# EAGLE design ESC (EAGLE 9.5.2)

## Sheet 1 of 3: Connectors
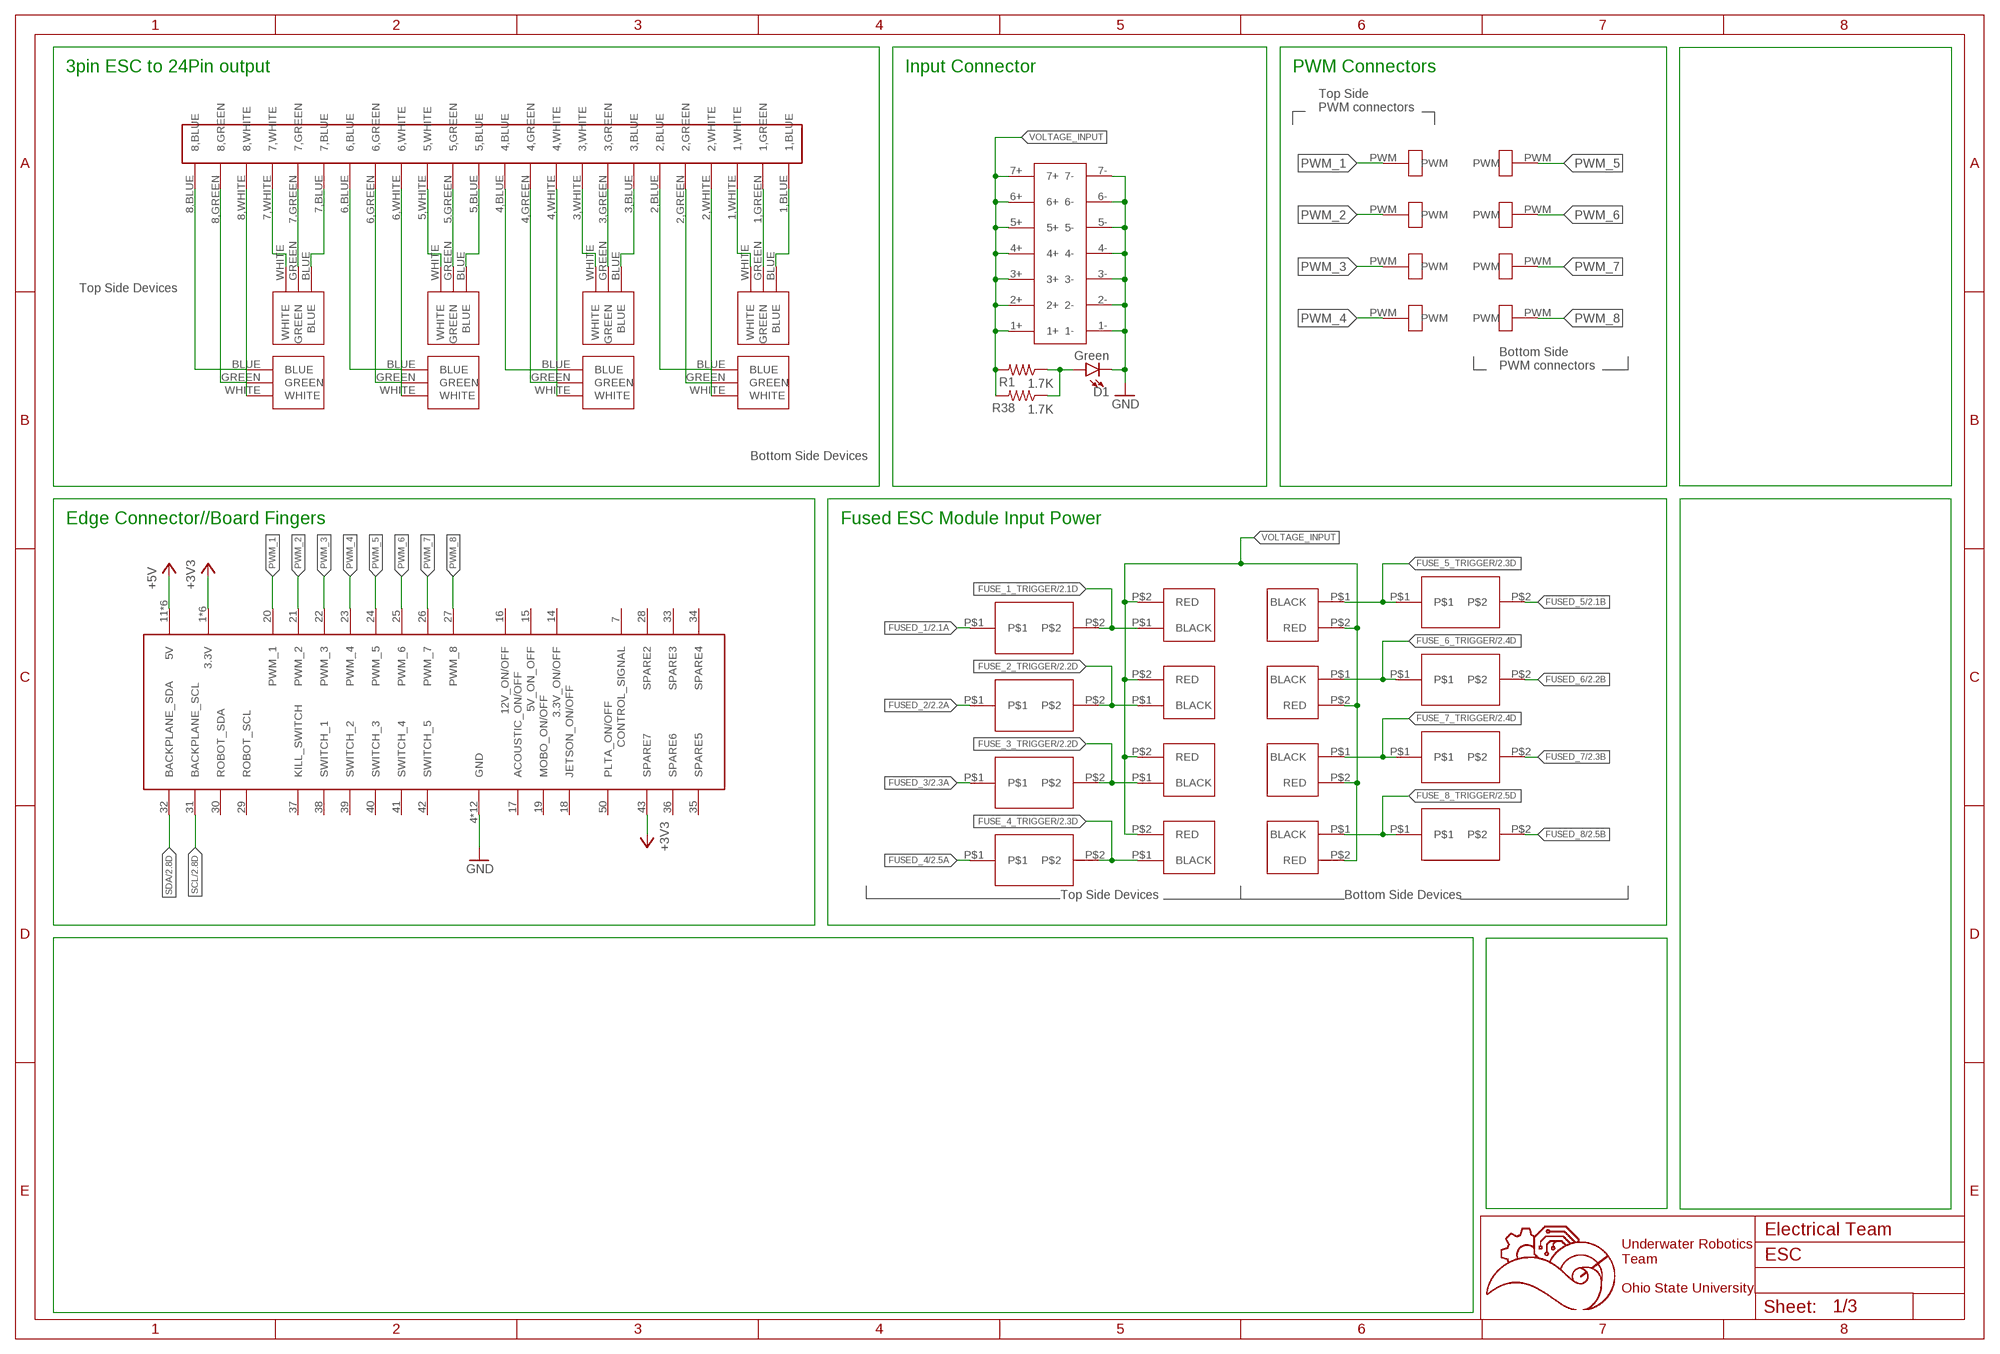
[diagram p0: schematic, sheet 1]

### Parts
2-PIN_1  1755736  [1755736]
2-PIN_2  1755736  [1755736]
2-PIN_3  1755736  [1755736]
2-PIN_4  1755736  [1755736]
2-PIN_5  1755736  [1755736]
2-PIN_6  1755736  [1755736]
2-PIN_7  1755736  [1755736]
2-PIN_8  1755736  [1755736]
3-PIN_1  1755749  [1755749]
3-PIN_2  1755749  [1755749]
3-PIN_3  1755749  [1755749]
3-PIN_4  1755749  [1755749]
3-PIN_5  1755749  [1755749]
3-PIN_6  1755749  [1755749]
3-PIN_7  1755749  [1755749]
3-PIN_8  1755749  [1755749]
24-PIN_CONNECTOR  24PINCONVERTER  [24PINCONVERTER]
D1  Green  LED0603  [LED-0603]
EDGE_CONNECTOR  5530843-EDGE  [5530843-6-BOARDFINGERS]
F1  1206FUSEHOLDER  [1206FUSEHOLDER]
F2  1206FUSEHOLDER  [1206FUSEHOLDER]
F3  1206FUSEHOLDER  [1206FUSEHOLDER]
F4  1206FUSEHOLDER  [1206FUSEHOLDER]
F5  1206FUSEHOLDER  [1206FUSEHOLDER]
F6  1206FUSEHOLDER  [1206FUSEHOLDER]
F7  1206FUSEHOLDER  [1206FUSEHOLDER]
F8  1206FUSEHOLDER  [1206FUSEHOLDER]
POWER_INPUT  14PIN_VERT  [14PIN_VERT]
R1  1.7K  R-US_R1210  [R1210]
R38  1.7K  R-US_R1210  [R1210]
U$1  MALE1PINHEADER  [MALE1PINHEADER]
U$2  MALE1PINHEADER  [MALE1PINHEADER]
U$3  MALE1PINHEADER  [MALE1PINHEADER]
U$4  MALE1PINHEADER  [MALE1PINHEADER]
U$5  MALE1PINHEADER  [MALE1PINHEADER]
U$6  MALE1PINHEADER  [MALE1PINHEADER]
U$7  MALE1PINHEADER  [MALE1PINHEADER]
U$8  MALE1PINHEADER  [MALE1PINHEADER]

### Nets
+3V3: EDGE_CONNECTOR.1(3.3V) EDGE_CONNECTOR.2(3.3V) EDGE_CONNECTOR.3(3.3V) EDGE_CONNECTOR.43(SPARE7) EDGE_CONNECTOR.54(3.3V) EDGE_CONNECTOR.55(3.3V) EDGE_CONNECTOR.56(3.3V) ; also sheet 2
+5V: EDGE_CONNECTOR.11(5V) EDGE_CONNECTOR.12(5V) EDGE_CONNECTOR.13(5V) EDGE_CONNECTOR.44(5V) EDGE_CONNECTOR.45(5V) EDGE_CONNECTOR.46(5V) ; also sheet 2
FUSE_1_TRIGGER: 2-PIN_1.P$1(BLACK) F1.P$2 ; also sheet 2
FUSE_2_TRIGGER: 2-PIN_2.P$1(BLACK) F2.P$2 ; also sheet 2
FUSE_3_TRIGGER: 2-PIN_3.P$1(BLACK) F3.P$2 ; also sheet 2
FUSE_4_TRIGGER: 2-PIN_4.P$1(BLACK) F4.P$2 ; also sheet 2
FUSE_5_TRIGGER: 2-PIN_5.P$1(BLACK) F5.P$1 ; also sheet 2
FUSE_6_TRIGGER: 2-PIN_6.P$1(BLACK) F6.P$1 ; also sheet 2
FUSE_7_TRIGGER: 2-PIN_7.P$1(BLACK) F7.P$1 ; also sheet 2
FUSE_8_TRIGGER: 2-PIN_8.P$1(BLACK) F8.P$1 ; also sheet 2
FUSED_1: F1.P$1 ; also sheet 2
FUSED_2: F2.P$1 ; also sheet 2
FUSED_3: F3.P$1 ; also sheet 2
FUSED_4: F4.P$1 ; also sheet 2
FUSED_5: F5.P$2 ; also sheet 2
FUSED_6: F6.P$2 ; also sheet 2
FUSED_7: F7.P$2 ; also sheet 2
FUSED_8: F8.P$2 ; also sheet 2
GND: D1.C EDGE_CONNECTOR.4(GND) EDGE_CONNECTOR.5(GND) EDGE_CONNECTOR.6(GND) EDGE_CONNECTOR.8(GND) EDGE_CONNECTOR.9(GND) EDGE_CONNECTOR.10(GND) EDGE_CONNECTOR.47(GND) EDGE_CONNECTOR.48(GND) EDGE_CONNECTOR.49(GND) EDGE_CONNECTOR.51(GND) EDGE_CONNECTOR.52(GND) EDGE_CONNECTOR.53(GND) POWER_INPUT.1- POWER_INPUT.2- POWER_INPUT.3- POWER_INPUT.4- POWER_INPUT.5- POWER_INPUT.6- POWER_INPUT.7- ; also sheet 2
N$1: 3-PIN_5.BLUE 24-PIN_CONNECTOR.8,BLUE
N$2: 3-PIN_5.GREEN 24-PIN_CONNECTOR.8,GREEN
N$3: 3-PIN_5.WHITE 24-PIN_CONNECTOR.8,WHITE
N$4: 3-PIN_1.GREEN 24-PIN_CONNECTOR.7,GREEN
N$5: 3-PIN_1.BLUE 24-PIN_CONNECTOR.7,BLUE
N$6: 3-PIN_1.WHITE 24-PIN_CONNECTOR.7,WHITE
N$7: 3-PIN_6.BLUE 24-PIN_CONNECTOR.6,BLUE
N$8: 3-PIN_6.GREEN 24-PIN_CONNECTOR.6,GREEN
N$9: 3-PIN_6.WHITE 24-PIN_CONNECTOR.6,WHITE
N$10: 3-PIN_2.WHITE 24-PIN_CONNECTOR.5,WHITE
N$11: 3-PIN_2.GREEN 24-PIN_CONNECTOR.5,GREEN
N$12: 3-PIN_2.BLUE 24-PIN_CONNECTOR.5,BLUE
N$13: 3-PIN_7.BLUE 24-PIN_CONNECTOR.4,BLUE
N$14: 3-PIN_7.GREEN 24-PIN_CONNECTOR.4,GREEN
N$15: 3-PIN_7.WHITE 24-PIN_CONNECTOR.4,WHITE
N$16: 3-PIN_3.WHITE 24-PIN_CONNECTOR.3,WHITE
N$17: 3-PIN_3.GREEN 24-PIN_CONNECTOR.3,GREEN
N$18: 3-PIN_3.BLUE 24-PIN_CONNECTOR.3,BLUE
N$19: 3-PIN_4.WHITE 24-PIN_CONNECTOR.1,WHITE
N$20: 3-PIN_4.BLUE 24-PIN_CONNECTOR.1,BLUE
N$21: 3-PIN_4.GREEN 24-PIN_CONNECTOR.1,GREEN
N$22: 3-PIN_8.BLUE 24-PIN_CONNECTOR.2,BLUE
N$23: 3-PIN_8.GREEN 24-PIN_CONNECTOR.2,GREEN
N$24: 3-PIN_8.WHITE 24-PIN_CONNECTOR.2,WHITE
N$26: D1.A R1.1 R38.1
PWM_1: EDGE_CONNECTOR.20(PWM_1) U$1.PWM
PWM_2: EDGE_CONNECTOR.21(PWM_2) U$2.PWM
PWM_3: EDGE_CONNECTOR.22(PWM_3) U$3.PWM
PWM_4: EDGE_CONNECTOR.23(PWM_4) U$4.PWM
PWM_5: EDGE_CONNECTOR.24(PWM_5) U$5.PWM
PWM_6: EDGE_CONNECTOR.25(PWM_6) U$6.PWM
PWM_7: EDGE_CONNECTOR.26(PWM_7) U$7.PWM
PWM_8: EDGE_CONNECTOR.27(PWM_8) U$8.PWM
SCL: EDGE_CONNECTOR.31(BACKPLANE_SCL) ; also sheet 2
SDA: EDGE_CONNECTOR.32(BACKPLANE_SDA) ; also sheet 2
VOLTAGE_INPUT: 2-PIN_1.P$2(RED) 2-PIN_2.P$2(RED) 2-PIN_3.P$2(RED) 2-PIN_4.P$2(RED) 2-PIN_5.P$2(RED) 2-PIN_6.P$2(RED) 2-PIN_7.P$2(RED) 2-PIN_8.P$2(RED) POWER_INPUT.1+ POWER_INPUT.2+ POWER_INPUT.3+ POWER_INPUT.4+ POWER_INPUT.5+ POWER_INPUT.6+ POWER_INPUT.7+ R1.2 R38.2
Unconnected: EDGE_CONNECTOR.7(CONTROL_SIGNAL) EDGE_CONNECTOR.14(3.3V_ON/OFF) EDGE_CONNECTOR.15(5V_ON_OFF) EDGE_CONNECTOR.16(12V_ON/OFF) EDGE_CONNECTOR.17(ACOUSTIC_ON/OFF) EDGE_CONNECTOR.18(JETSON_ON/OFF) EDGE_CONNECTOR.19(MOBO_ON/OFF) EDGE_CONNECTOR.28(SPARE2) EDGE_CONNECTOR.29(ROBOT_SCL) EDGE_CONNECTOR.30(ROBOT_SDA) EDGE_CONNECTOR.33(SPARE3) EDGE_CONNECTOR.34(SPARE4) EDGE_CONNECTOR.35(SPARE5) EDGE_CONNECTOR.36(SPARE6) EDGE_CONNECTOR.37(KILL_SWITCH) EDGE_CONNECTOR.38(SWITCH_1) EDGE_CONNECTOR.39(SWITCH_2) EDGE_CONNECTOR.40(SWITCH_3) EDGE_CONNECTOR.41(SWITCH_4) EDGE_CONNECTOR.42(SWITCH_5) EDGE_CONNECTOR.50(PLTA_ON/OFF)

### Notes on the sheet
- 3pin ESC to 24Pin output | Input Connector | PWM Connectors
- Top Side
  PWM connectors
- Top Side Devices
- Bottom Side
  PWM connectors
- Bottom Side Devices
- Edge Connector//Board Fingers | Fused ESC Module Input Power
- Top Side Devices | Bottom Side Devices
- Electrical Team
- Underwater Robotics
  Team
  
  Ohio State University

## Sheet 2 of 3: Circuit
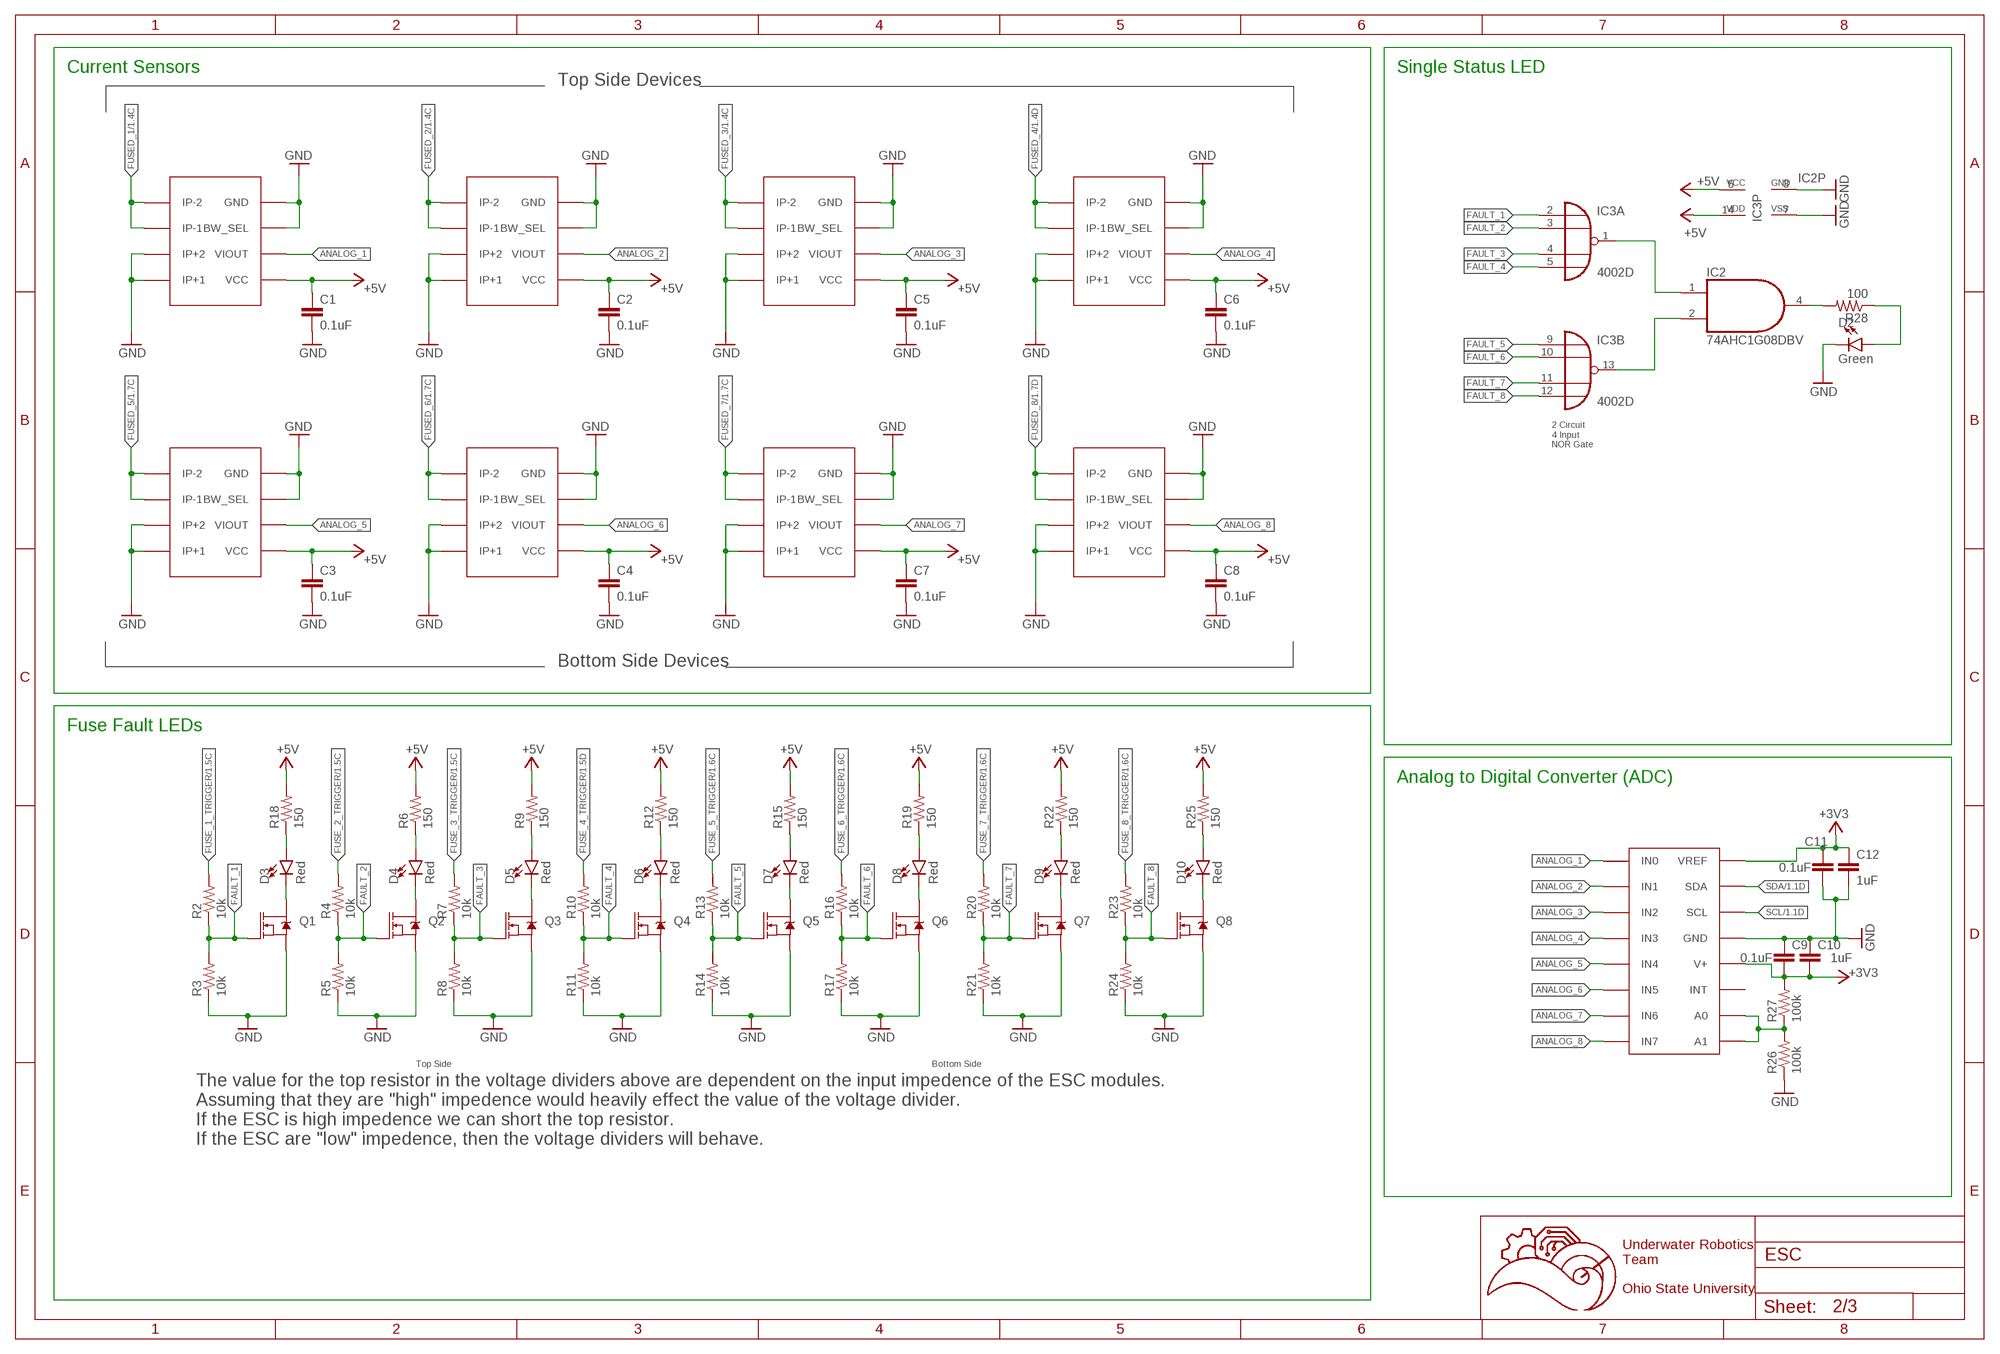
[diagram p1: schematic, sheet 2]

### Parts
C1  0.1uF  C-EUC0603  [C0603]
C2  0.1uF  C-EUC0603  [C0603]
C3  0.1uF  C-EUC0603  [C0603]
C4  0.1uF  C-EUC0603  [C0603]
C5  0.1uF  C-EUC0603  [C0603]
C6  0.1uF  C-EUC0603  [C0603]
C7  0.1uF  C-EUC0603  [C0603]
C8  0.1uF  C-EUC0603  [C0603]
C9  0.1uF  C-EUC0603  [C0603]
C10  1uF  C-EUC0603  [C0603]
C11  0.1uF  C-EUC0603  [C0603]
C12  1uF  C-EUC0603  [C0603]
CS_1  ACS722  [SOIC-8]
CS_2  ACS722  [SOIC-8]
CS_3  ACS722  [SOIC-8]
CS_4  ACS722  [SOIC-8]
CS_5  ACS722  [SOIC-8]
CS_6  ACS722  [SOIC-8]
CS_7  ACS722  [SOIC-8]
CS_8  ACS722  [SOIC-8]
D2  Green  LED0603  [LED-0603]
D3  Red  LED0603  [LED-0603]
D4  Red  LED0603  [LED-0603]
D5  Red  LED0603  [LED-0603]
D6  Red  LED0603  [LED-0603]
D7  Red  LED0603  [LED-0603]
D8  Red  LED0603  [LED-0603]
D9  Red  LED0603  [LED-0603]
D10  Red  LED0603  [LED-0603]
IC2  74AHC1G08DBV  [SOT23-5]
IC3  4002D  [SO14]
Q1  5.8A/30V/35mΩ  MOSFET-NCH-AO3404A  [SOT23-3]
Q2  5.8A/30V/35mΩ  MOSFET-NCH-AO3404A  [SOT23-3]
Q3  5.8A/30V/35mΩ  MOSFET-NCH-AO3404A  [SOT23-3]
Q4  5.8A/30V/35mΩ  MOSFET-NCH-AO3404A  [SOT23-3]
Q5  5.8A/30V/35mΩ  MOSFET-NCH-AO3404A  [SOT23-3]
Q6  5.8A/30V/35mΩ  MOSFET-NCH-AO3404A  [SOT23-3]
Q7  5.8A/30V/35mΩ  MOSFET-NCH-AO3404A  [SOT23-3]
Q8  5.8A/30V/35mΩ  MOSFET-NCH-AO3404A  [SOT23-3]
R2  10k  R-US_R0603  [R0603]
R3  10k  R-US_R0603  [R0603]
R4  10k  R-US_R0603  [R0603]
R5  10k  R-US_R0603  [R0603]
R6  150  R-US_R0603  [R0603]
R7  10k  R-US_R0603  [R0603]
R8  10k  R-US_R0603  [R0603]
R9  150  R-US_R0603  [R0603]
R10  10k  R-US_R0603  [R0603]
R11  10k  R-US_R0603  [R0603]
R12  150  R-US_R0603  [R0603]
R13  10k  R-US_R0603  [R0603]
R14  10k  R-US_R0603  [R0603]
R15  150  R-US_R0603  [R0603]
R16  10k  R-US_R0603  [R0603]
R17  10k  R-US_R0603  [R0603]
R18  150  R-US_R0603  [R0603]
R19  150  R-US_R0603  [R0603]
R20  10k  R-US_R0603  [R0603]
R21  10k  R-US_R0603  [R0603]
R22  150  R-US_R0603  [R0603]
R23  10k  R-US_R0603  [R0603]
R24  10k  R-US_R0603  [R0603]
R25  150  R-US_R0603  [R0603]
R26  100k  R-US_R0603  [R0603]
R27  100k  R-US_R0603  [R0603]
R28  100  R-US_R0603  [R0603]
U$11  ADC128D818  [TSSOP-16]

### Nets
+3V3: C9.2 C10.2 C11.1 C12.1 R27.2 U$11.V+ U$11.VREF ; also sheet 1
+5V: C1.1 C2.1 C3.1 C4.1 C5.1 C6.1 C7.1 C8.1 CS_1.VCC CS_2.VCC CS_3.VCC CS_4.VCC CS_5.VCC CS_6.VCC CS_7.VCC CS_8.VCC IC2.5(VCC) IC3.14(P:VDD) R6.2 R9.2 R12.2 R15.2 R18.2 R19.2 R22.2 R25.2 ; also sheet 1
ANALOG_1: CS_1.VIOUT U$11.IN0
ANALOG_2: CS_2.VIOUT U$11.IN1
ANALOG_3: CS_3.VIOUT U$11.IN2
ANALOG_4: CS_4.VIOUT U$11.IN3
ANALOG_5: CS_5.VIOUT U$11.IN4
ANALOG_6: CS_6.VIOUT U$11.IN5
ANALOG_7: CS_7.VIOUT U$11.IN6
ANALOG_8: CS_8.VIOUT U$11.IN7
FAULT_1: IC3.2(A:I0) Q1.1(G) R2.1 R3.2
FAULT_2: IC3.3(A:I1) Q2.1(G) R4.1 R5.2
FAULT_3: IC3.4(A:I2) Q3.1(G) R7.1 R8.2
FAULT_4: IC3.5(A:I3) Q4.1(G) R10.1 R11.2
FAULT_5: IC3.9(B:I0) Q5.1(G) R13.1 R14.2
FAULT_6: IC3.10(B:I1) Q6.1(G) R16.1 R17.2
FAULT_7: IC3.11(B:I2) Q7.1(G) R20.1 R21.2
FAULT_8: IC3.12(B:I3) Q8.1(G) R23.1 R24.2
FUSE_1_TRIGGER: R2.2 ; also sheet 1
FUSE_2_TRIGGER: R4.2 ; also sheet 1
FUSE_3_TRIGGER: R7.2 ; also sheet 1
FUSE_4_TRIGGER: R10.2 ; also sheet 1
FUSE_5_TRIGGER: R13.2 ; also sheet 1
FUSE_6_TRIGGER: R16.2 ; also sheet 1
FUSE_7_TRIGGER: R20.2 ; also sheet 1
FUSE_8_TRIGGER: R23.2 ; also sheet 1
FUSED_1: CS_1.IP-1 CS_1.IP-2 ; also sheet 1
FUSED_2: CS_2.IP-1 CS_2.IP-2 ; also sheet 1
FUSED_3: CS_3.IP-1 CS_3.IP-2 ; also sheet 1
FUSED_4: CS_4.IP-1 CS_4.IP-2 ; also sheet 1
FUSED_5: CS_5.IP-1 CS_5.IP-2 ; also sheet 1
FUSED_6: CS_6.IP-1 CS_6.IP-2 ; also sheet 1
FUSED_7: CS_7.IP-1 CS_7.IP-2 ; also sheet 1
FUSED_8: CS_8.IP-1 CS_8.IP-2 ; also sheet 1
GND: C1.2 C2.2 C3.2 C4.2 C5.2 C6.2 C7.2 C8.2 C9.1 C10.1 C11.2 C12.2 CS_1.BW_SEL CS_1.GND CS_1.IP+1 CS_1.IP+2 CS_2.BW_SEL CS_2.GND CS_2.IP+1 CS_2.IP+2 CS_3.BW_SEL CS_3.GND CS_3.IP+1 CS_3.IP+2 CS_4.BW_SEL CS_4.GND CS_4.IP+1 CS_4.IP+2 CS_5.BW_SEL CS_5.GND CS_5.IP+1 CS_5.IP+2 CS_6.BW_SEL CS_6.GND CS_6.IP+1 CS_6.IP+2 CS_7.BW_SEL CS_7.GND CS_7.IP+1 CS_7.IP+2 CS_8.BW_SEL CS_8.GND CS_8.IP+1 CS_8.IP+2 D2.C IC2.3(GND) IC3.7(P:VSS) Q1.2(S) Q2.2(S) Q3.2(S) Q4.2(S) Q5.2(S) Q6.2(S) Q7.2(S) Q8.2(S) R3.1 R5.1 R8.1 R11.1 R14.1 R17.1 R21.1 R24.1 R26.1 U$11.GND ; also sheet 1
N$31: IC2.4(O) R28.2
N$32: D3.C Q1.3(D)
N$33: D3.A R18.1
N$34: D4.C Q2.3(D)
N$36: D4.A R6.1
N$37: D5.C Q3.3(D)
N$40: D5.A R9.1
N$41: D6.C Q4.3(D)
N$42: D6.A R12.1
N$44: D7.C Q5.3(D)
N$45: D7.A R15.1
N$46: D8.C Q6.3(D)
N$47: D8.A R19.1
N$48: D9.C Q7.3(D)
N$50: D9.A R22.1
N$51: D10.C Q8.3(D)
N$53: D10.A R25.1
N$56: D2.A R28.1
N$62: R26.2 R27.1 U$11.A0 U$11.A1
NOR_1_OUT: IC2.1(I0) IC3.1(A:O)
NOR_2_OUT: IC2.2(I1) IC3.13(B:O)
SCL: U$11.SCL ; also sheet 1
SDA: U$11.SDA ; also sheet 1
Unconnected: U$11.INT

### Notes on the sheet
- Current Sensors | Single Status LED
- Top Side Devices
- 2 Circuit 
  4 Input
  NOR Gate
- Bottom Side Devices
- Fuse Fault LEDs
- Analog to Digital Converter (ADC)
- Top Side | Bottom Side
- The value for the top resistor in the voltage dividers above are dependent on the input impedence of the ESC modules.
  Assuming that they are "high" impedence would heavily effect the value of the voltage divider. 
  If the ESC is high impedence we can short the top resistor.
  If the ESC are "low" impedence, then the voltage dividers will behave.
- Underwater Robotics
  Team
  
  Ohio State University

## Sheet 3 of 3: Notes and Datasheets
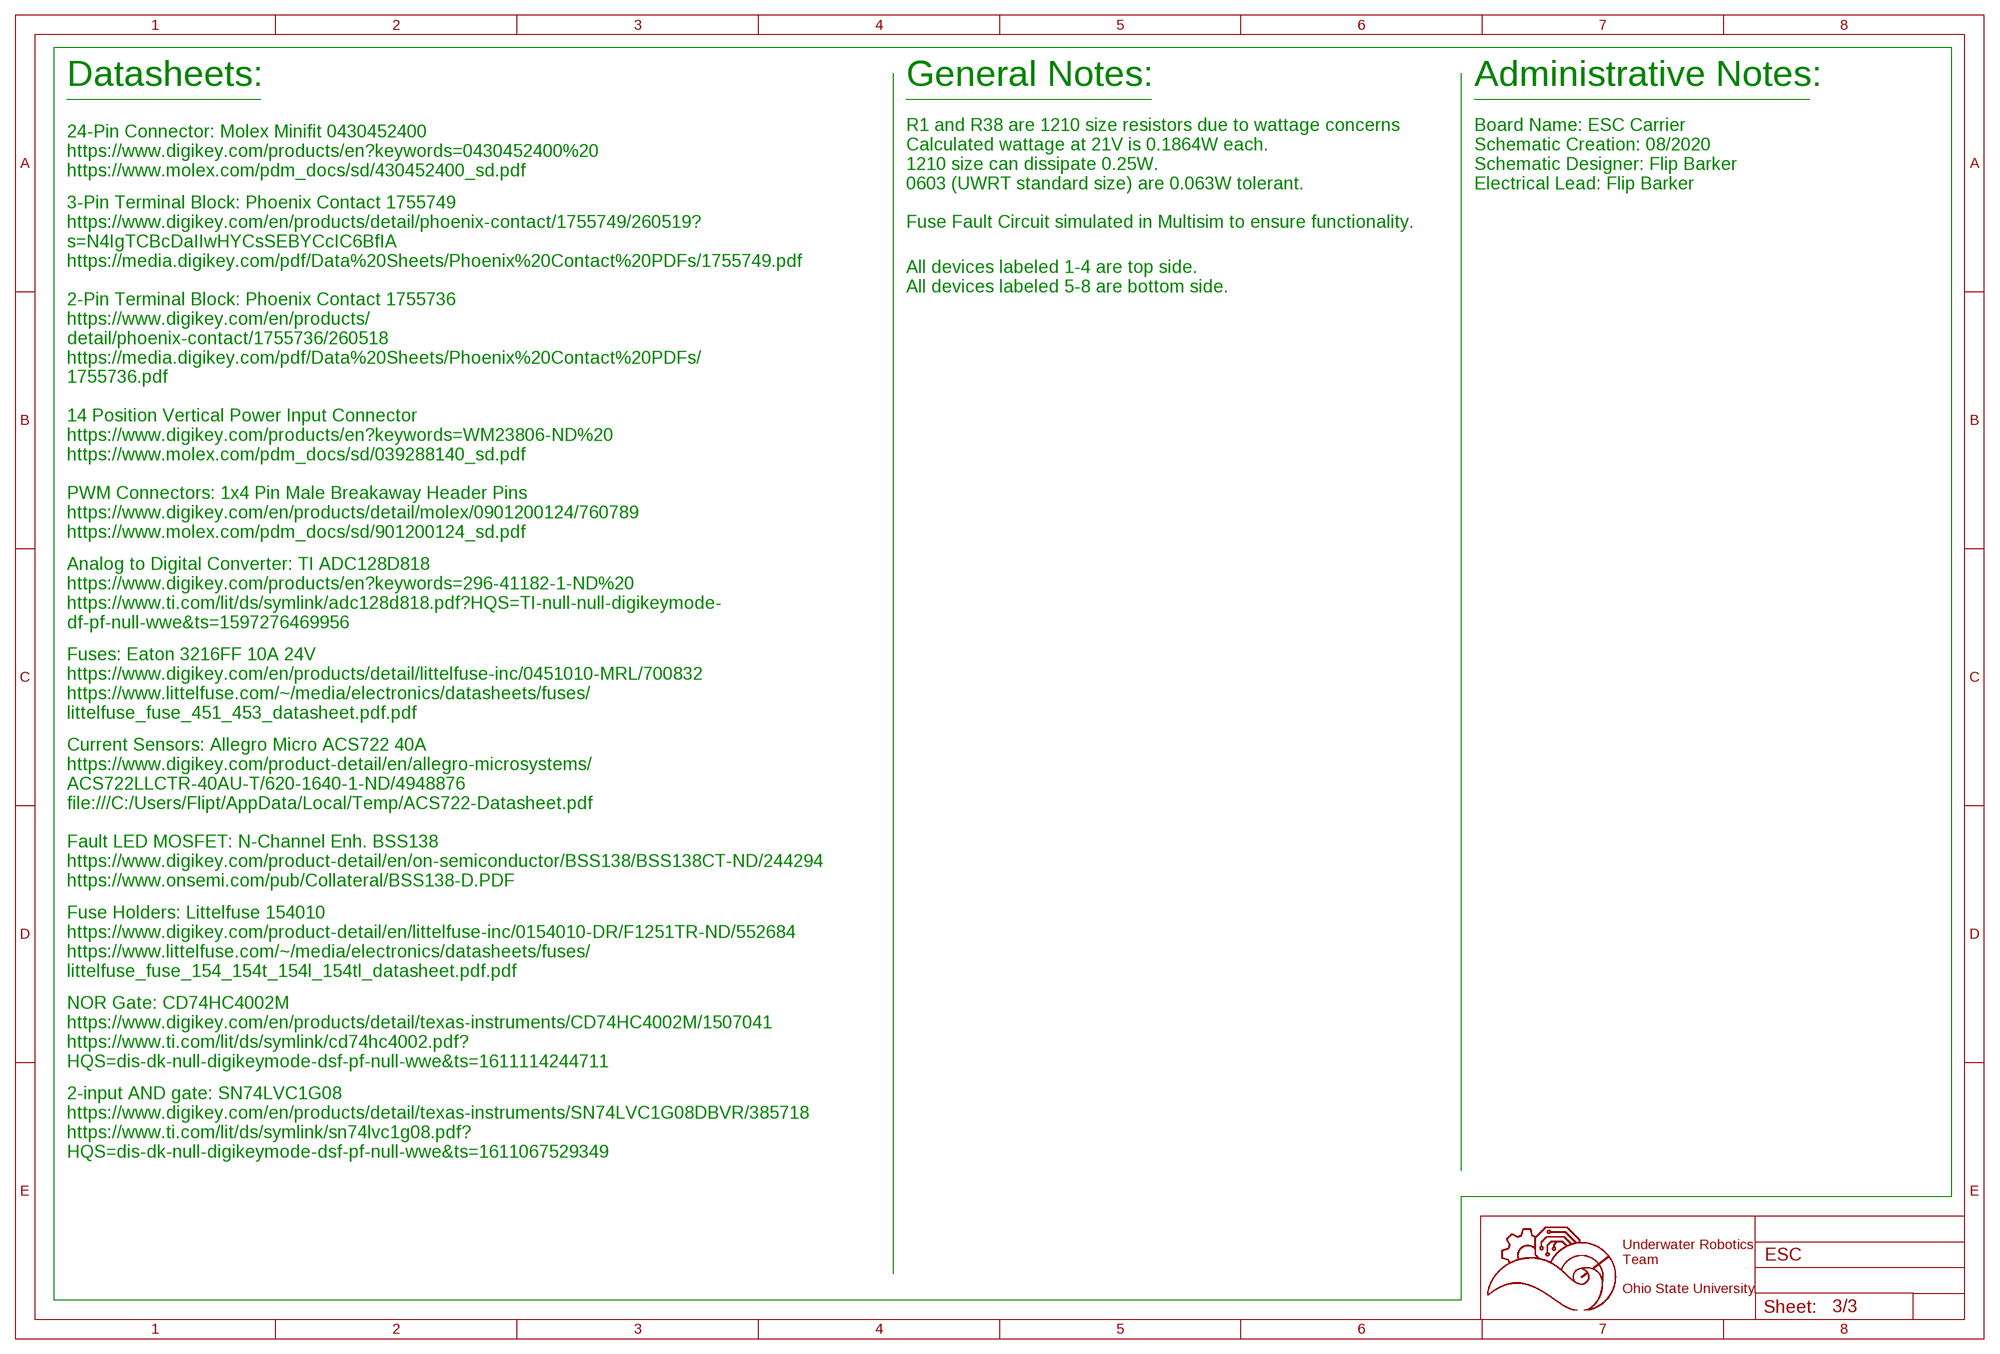
[diagram p2: schematic, sheet 3]

### Notes on the sheet
- Datasheets: | General Notes: | Administrative Notes:
- 24-Pin Connector: Molex Minifit 0430452400
  https://www.digikey.com/products/en?keywords=0430452400%20
  https://www.molex.com/pdm_docs/sd/430452400_sd.pdf
- R1 and R38 are 1210 size resistors due to wattage concerns
  Calculated wattage at 21V is 0.1864W each.
  1210 size can dissipate 0.25W. 
  0603 (UWRT standard size) are 0.063W tolerant.
- Board Name: ESC Carrier
  Schematic Creation: 08/2020
  Schematic Designer: Flip Barker
  Electrical Lead: Flip Barker
- Fuse Fault Circuit simulated in Multisim to ensure functionality.
- 3-Pin Terminal Block: Phoenix Contact 1755749
  https://www.digikey.com/en/products/detail/phoenix-contact/1755749/260519?
  s=N4IgTCBcDaIIwHYCsSEBYCcIC6BfIA
  https://media.digikey.com/pdf/Data%20Sheets/Phoenix%20Contact%20PDFs/1755749.pdf
- All devices labeled 1-4 are top side.
  All devices labeled 5-8 are bottom side.
- 2-Pin Terminal Block: Phoenix Contact 1755736
  https://www.digikey.com/en/products/
  detail/phoenix-contact/1755736/260518
  https://media.digikey.com/pdf/Data%20Sheets/Phoenix%20Contact%20PDFs/
  1755736.pdf
- 14 Position Vertical Power Input Connector
  https://www.digikey.com/products/en?keywords=WM23806-ND%20
  https://www.molex.com/pdm_docs/sd/039288140_sd.pdf
- PWM Connectors: 1x4 Pin Male Breakaway Header Pins
  https://www.digikey.com/en/products/detail/molex/0901200124/760789
  https://www.molex.com/pdm_docs/sd/901200124_sd.pdf
- Analog to Digital Converter: TI ADC128D818
  https://www.digikey.com/products/en?keywords=296-41182-1-ND%20
  https://www.ti.com/lit/ds/symlink/adc128d818.pdf?HQS=TI-null-null-digikeymode-
  df-pf-null-wwe&ts=1597276469956
- Fuses: Eaton 3216FF 10A 24V
  https://www.digikey.com/en/products/detail/littelfuse-inc/0451010-MRL/700832
  https://www.littelfuse.com/~/media/electronics/datasheets/fuses/
  littelfuse_fuse_451_453_datasheet.pdf.pdf
- Current Sensors: Allegro Micro ACS722 40A
  https://www.digikey.com/product-detail/en/allegro-microsystems/
  ACS722LLCTR-40AU-T/620-1640-1-ND/4948876
  file:///C:/Users/Flipt/AppData/Local/Temp/ACS722-Datasheet.pdf
- Fault LED MOSFET: N-Channel Enh. BSS138
  https://www.digikey.com/product-detail/en/on-semiconductor/BSS138/BSS138CT-ND/244294
  https://www.onsemi.com/pub/Collateral/BSS138-D.PDF
- Fuse Holders: Littelfuse 154010
  https://www.digikey.com/product-detail/en/littelfuse-inc/0154010-DR/F1251TR-ND/552684
  https://www.littelfuse.com/~/media/electronics/datasheets/fuses/
  littelfuse_fuse_154_154t_154l_154tl_datasheet.pdf.pdf
- NOR Gate: CD74HC4002M
  https://www.digikey.com/en/products/detail/texas-instruments/CD74HC4002M/1507041
  https://www.ti.com/lit/ds/symlink/cd74hc4002.pdf?
  HQS=dis-dk-null-digikeymode-dsf-pf-null-wwe&ts=1611114244711
- 2-input AND gate: SN74LVC1G08
  https://www.digikey.com/en/products/detail/texas-instruments/SN74LVC1G08DBVR/385718
  https://www.ti.com/lit/ds/symlink/sn74lvc1g08.pdf?
  HQS=dis-dk-null-digikeymode-dsf-pf-null-wwe&ts=1611067529349
- Underwater Robotics
  Team
  
  Ohio State University

## Library data of the parts
2-PIN_1-2-PIN_8 = Screw_Terminals:1755736: Pheonix Contacts 1755736 2 contact male pins Board mount WILL NEED CORRESPONDING PLUG 5.08mm Pitch
3-PIN_1-3-PIN_8 = Screw_Terminals:1755749: Pheonix Contacts 1755749 3 contact male pins Board mount WILL NEED CORRESPONDING PLUG 5.08mm Pitch
24-PIN_CONNECTOR = 24_Pin_Connector:24PINCONVERTER
C1-C12 = rcl:C-EU: CAPACITOR, European symbol; SPICEPREFIX: C
CS_1-CS_8 = ACS722:ACS722
D1-D10 = SparkFun-LED:LED: LED (Generic) Standard schematic elements and footprints for 5mm, 3mm, 1206, and 0603 sized LEDs. Generic LEDs with no color specified.
EDGE_CONNECTOR = 5530843-6:5530843-EDGE
F1-F8 = 1206 fuse holder:1206FUSEHOLDER: 1206 Fuse Holder: LittelFuse Inc https://www.littelfuse.com/~/media/electronics/datasheets/fuses/littelfuse_fuse_154_154t_154l_154tl_datasheet.pdf.pdf
IC2 = 74xx-little-us:74*1G08: 2-input AND gate
IC3 = 40xx:4002: 4-input NOR
POWER_INPUT = 14_Pin_Connector_Vert:14PIN_VERT
Q1-Q8 = SparkFun-DiscreteSemi:MOSFET-NCH: N-channel MOSFETs Voltage controlled devices that allow control of high current outputs. SparkFun Products: SparkFun OpenScale <https://www.sparkfun.com/products/13261> SparkFun Digital Sandbox <https://www.sparkfun.com/products/12651> SparkFun Monster Moto Shield <https://www.sparkfun.com/products/10182> SparkFun MOSFET Power Controller <https://www.sparkfun.com/products/11214>; PROD_ID: TRANS-12988
R1-R28 R38 = rcl:R-US_: RESISTOR, American symbol; SPICEPREFIX: R
U$1-U$8 = Male_Header_1Pin:MALE1PINHEADER
U$11 = ADC128D818:ADC128D818

## Board
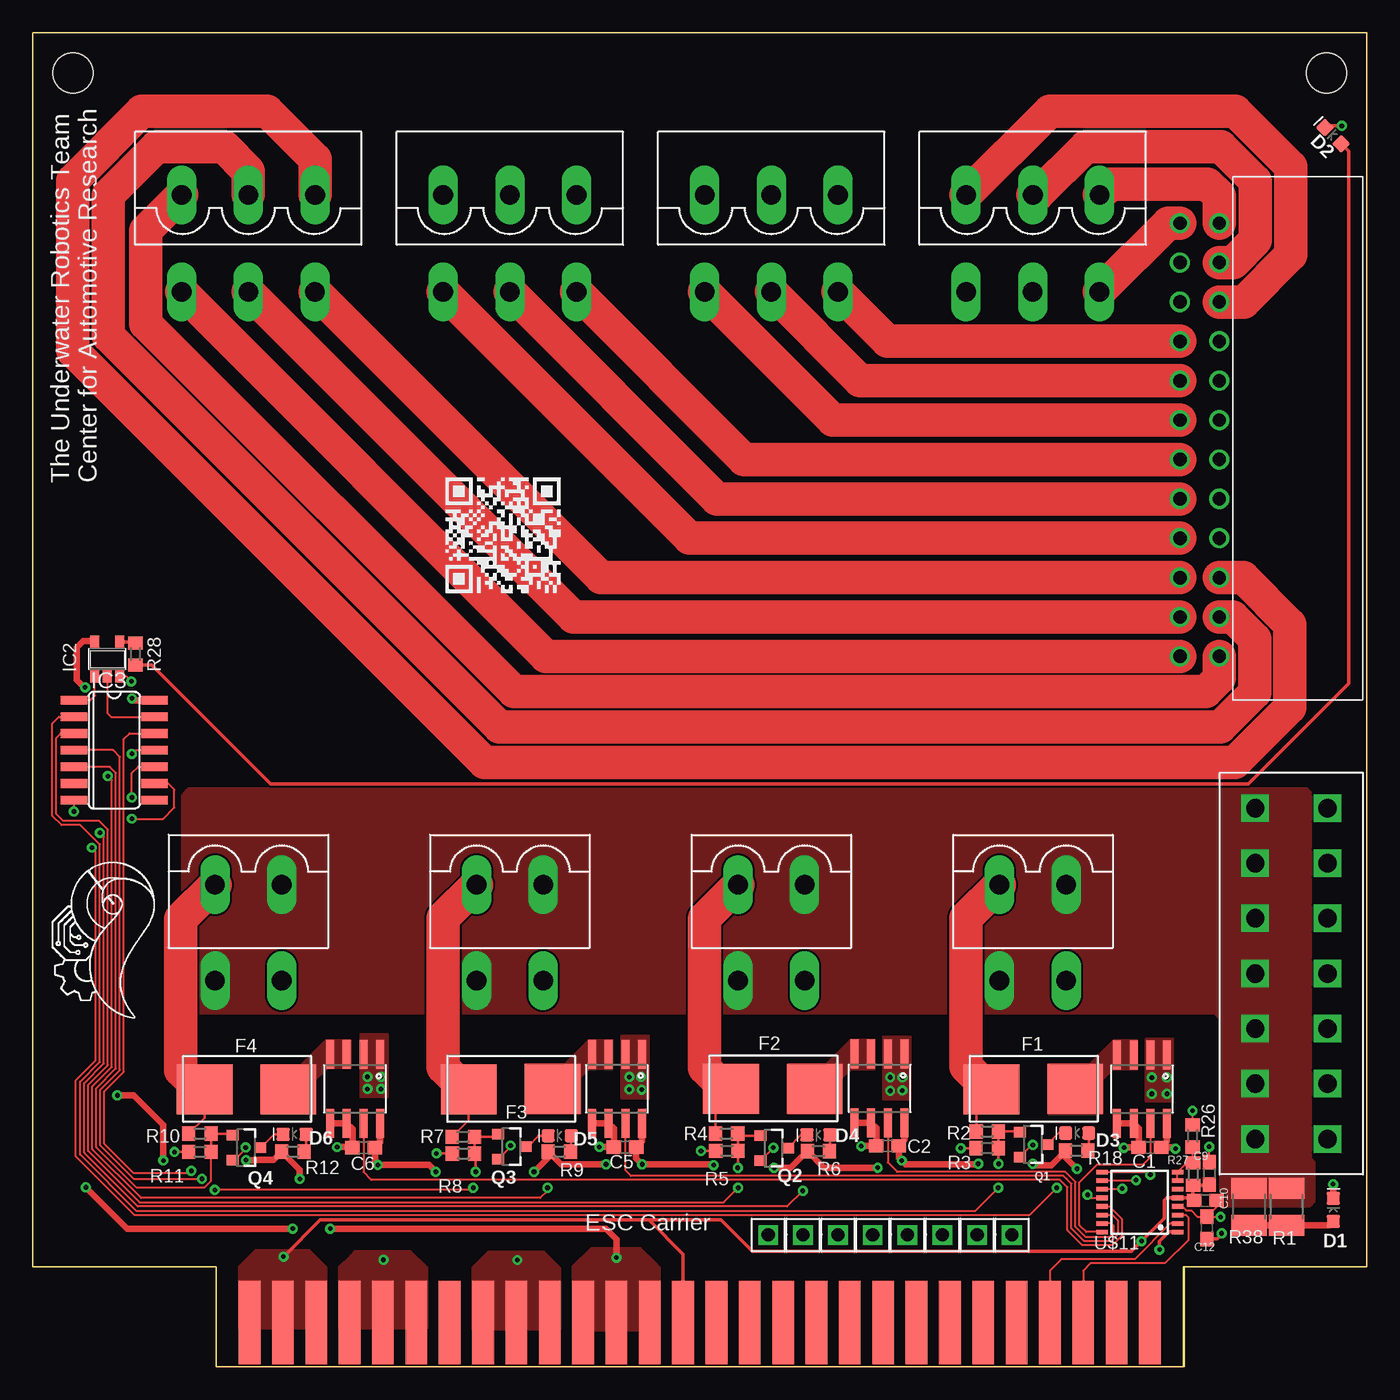
[diagram p3: board, top side]
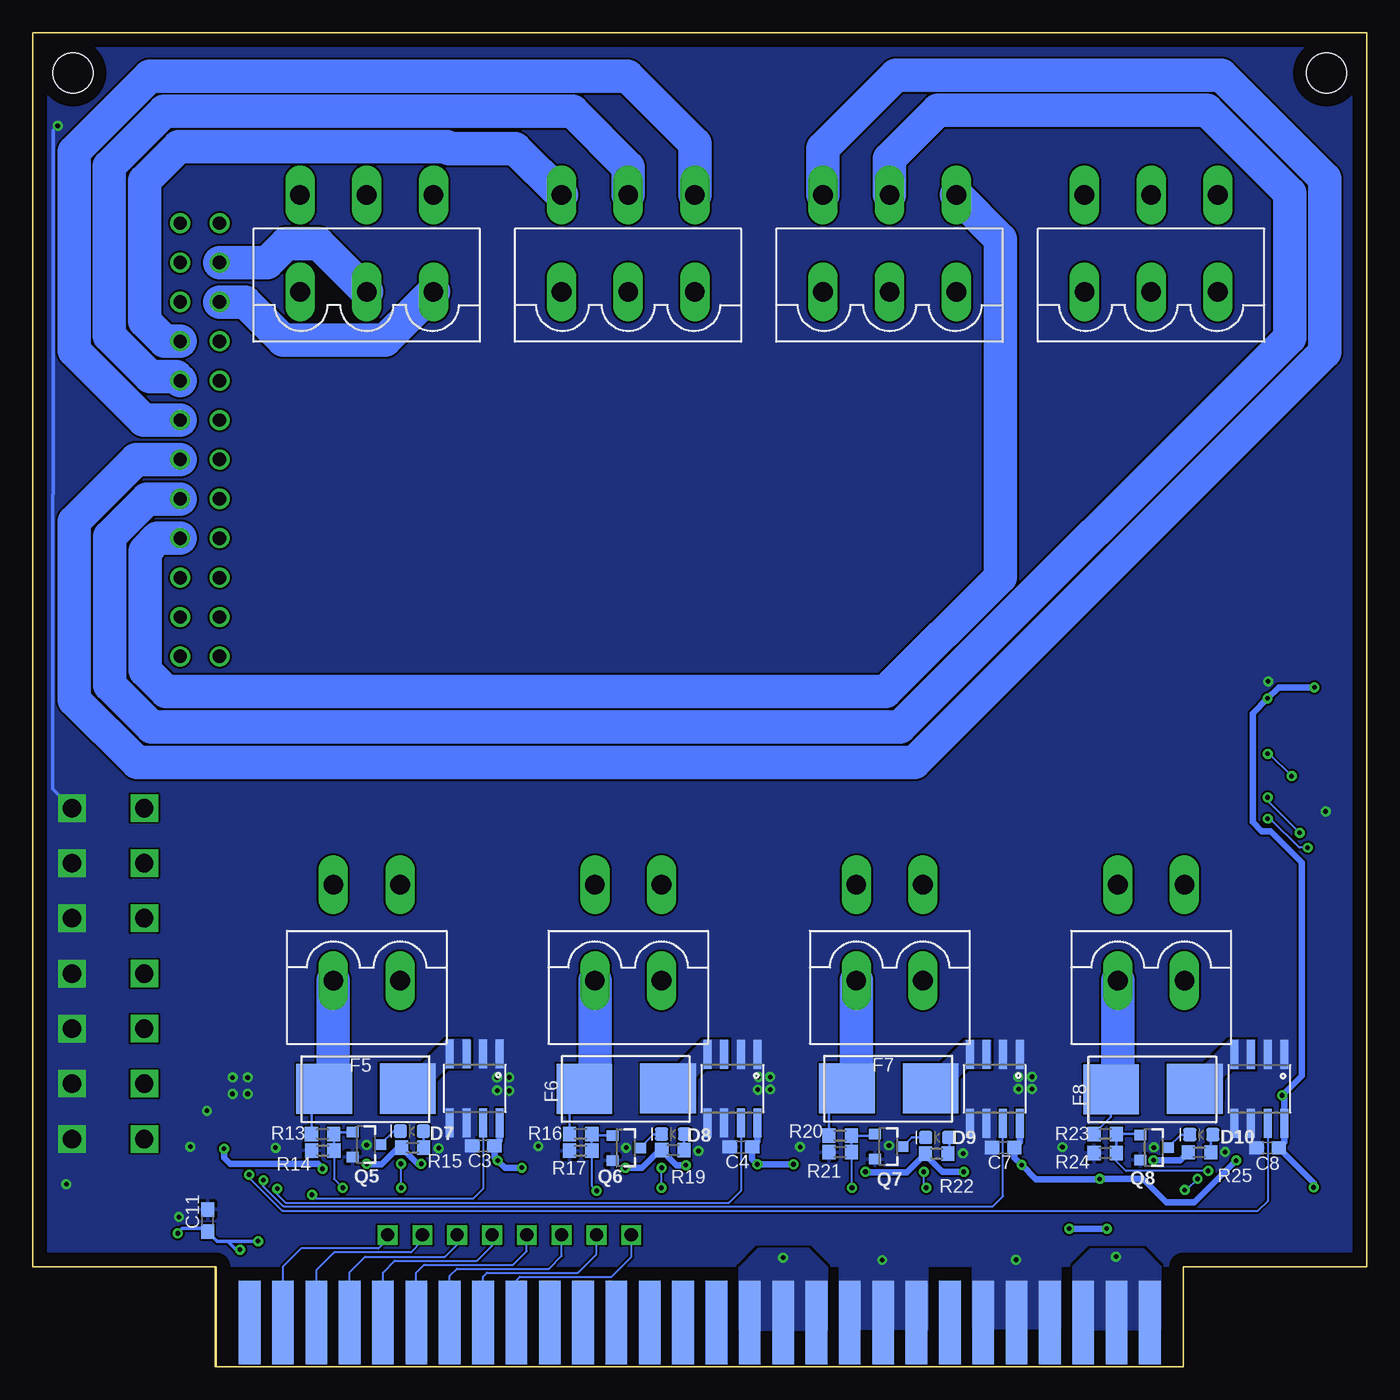
[diagram p4: board, bottom side, seen from below]

Size 101.6 x 101.6 mm. Coordinates in mm from the lower left corner, seen from the top.
Outline: 0,7.62 0,101.6 101.6,101.6 101.6,7.62 87.63,7.62 87.63,0 13.97,0 13.97,7.62 0,7.62
Copper layers (1*16): Top 0.035mm / dielectric 1.5mm / Bottom 0.035mm
Design rules "default": minimum track width 6mil, minimum drill 0.35mm, track to track 6mil, track to pad 6mil, pad to pad 6mil, via to via 6mil, smd to smd 6mil, copper to edge 40mil, drill to drill 6mil, minimum pad ring 10mil, minimum via ring 8mil, stop-mask expansion 4mil, vias tented up to drill 0mil, thermal gap 10mil
Holes 3.05 mm at 3.05,98.55 98.55,98.55

### Footprints (pad centres in the part's own frame; a part is rotated, then mirrored left to right if it is on the bottom)
1755736 = drill 1.5 long: P$1 -2.54,0; P$2 2.54,0
1755749 = drill 1.5 long: BLUE 5.08,0; GREEN 0,0; WHITE -5.08,0
24PINCONVERTER = drill 1.02: 1,BLUE 3,0; 1,GREEN 3,3; 1,WHITE 3,6; 2,BLUE 0,6; 2,GREEN 0,3; 2,WHITE 0,0; 3,BLUE 3,9; 3,GREEN 3,12; 3,WHITE 3,15; 4,BLUE 0,15; 4,GREEN 0,12; 4,WHITE 0,9; 5,BLUE 3,18; 5,GREEN 3,21; 5,WHITE 3,24; 6,BLUE 0,24; 6,GREEN 0,21; 6,WHITE 0,18; 7,BLUE 3,27; 7,GREEN 3,30; 7,WHITE 3,33; 8,BLUE 0,33; 8,GREEN 0,30; 8,WHITE 0,27
C0603 = smd 1.1 x 1: 1 -0.85,0; 2 0.85,0
SOIC-8 = smd 0.61 x 2.21: BW_SEL 0.635,2.616; GND 1.905,2.616; IP+1 -1.905,-2.616; IP+2 -0.635,-2.616; IP-1 0.635,-2.616; IP-2 1.905,-2.616; VCC -1.905,2.616; VIOUT -0.635,2.616
LED-0603 = smd 1 x 1: A -0.877,0; C 0.877,0
5530843-6-BOARDFINGERS = smd 1.651 x 6.35 bottom: 1 0.826,3.375; 2 3.365,3.375; 3 5.905,3.375; 4 8.445,3.375; 5 10.986,3.375; 6 13.525,3.375; 7 16.066,3.375; 8 18.605,3.375; 9 21.145,3.375; 10 23.686,3.375; 11 26.226,3.375; 12 28.765,3.375; 13 31.305,3.375; 14 33.846,3.375; 15 36.386,3.375; 16 38.925,3.375; 17 41.465,3.375; 18 44.005,3.375; 19 46.545,3.375; 20 49.086,3.375; 21 51.626,3.375; 22 54.166,3.375; 23 56.706,3.375; 24 59.245,3.375; 25 61.785,3.375; 26 64.326,3.375; 27 66.865,3.375; 28 69.406,3.375 | smd 1.651 x 6.35: 29 69.406,3.375; 30 66.865,3.375; 31 64.326,3.375; 32 61.785,3.375; 33 59.245,3.375; 34 56.706,3.375; 35 54.166,3.375; 36 51.626,3.375; 37 49.086,3.375; 38 46.545,3.375; 39 44.005,3.375; 40 41.465,3.375; 41 38.925,3.375; 42 36.386,3.375; 43 33.846,3.375; 44 31.305,3.375; 45 28.765,3.375; 46 26.226,3.375; 47 23.686,3.375; 48 21.145,3.375; 49 18.605,3.375; 50 16.066,3.375; 51 13.525,3.375; 52 10.986,3.375; 53 8.445,3.375; 54 5.905,3.375; 55 3.365,3.375; 56 0.826,3.375
1206FUSEHOLDER = smd 4.24 x 3.81: P$1 -3.19,0; P$2 3.19,0.02
SOT23-5 = smd 0.69 x 0.99: 1 -0.95,-1.29; 2 0,-1.29; 3 0.95,-1.29; 4 0.95,1.3; 5 -0.95,1.3
SO14 = smd 0.66 x 2.032: 1 -3.81,-3.073; 2 -2.54,-3.073; 3 -1.27,-3.073; 4 0,-3.073; 5 1.27,-3.073; 6 2.54,-3.073; 7 3.81,-3.073; 8 3.81,3.073; 9 2.54,3.073; 10 1.27,3.073; 11 0,3.073; 12 -1.27,3.073; 13 -2.54,3.073; 14 -3.81,3.073
14PIN_VERT = drill 1.4 square: 1+ 0,0; 1- 5.5,0; 2+ 0,4.2; 2- 5.5,4.2; 3+ 0,8.4; 3- 5.5,8.4; 4+ 0,12.6; 4- 5.5,12.6; 5+ 0,16.8; 5- 5.5,16.8; 6+ 0,21; 6- 5.5,21; 7+ 0,25.2; 7- 5.5,25.2
SOT23-3 = smd 0.8 x 0.9: 1 -0.95,-1; 2 0.95,-1; 3 0,1.1
R1210 = smd 1.6 x 2.7: 1 -1.4,0; 2 1.4,0
R0603 = smd 1 x 1.1: 1 -0.85,0; 2 0.85,0
MALE1PINHEADER = drill 1 square: PWM 0,0
TSSOP-16 = smd 0.9 x 0.35: A0 -2.875,-1.625; A1 -2.875,-2.275; GND -2.875,0.325; IN0 2.875,2.275; IN1 2.875,1.625; IN2 2.875,0.975; IN3 2.875,0.325; IN4 2.875,-0.325; IN5 2.875,-0.975; IN6 2.875,-1.625; IN7 2.875,-2.275; INT -2.875,-0.975; SCL -2.875,0.975; SDA -2.875,1.625; V+ -2.875,-0.325; VREF -2.875,2.275

### Placement (x,y rotation side)
2-PIN_1  76.17,36.71 0 top
2-PIN_2  56.25,36.71 0 top
2-PIN_3  36.34,36.71 0 top
2-PIN_4  16.42,36.71 0 top
2-PIN_5  76.17,29.41 0 bottom
2-PIN_6  56.25,29.41 0 bottom
2-PIN_7  36.34,29.41 0 bottom
2-PIN_8  16.42,29.41 0 bottom
3-PIN_1  76.17,89.25 180 top
3-PIN_2  56.25,89.25 180 top
3-PIN_3  36.34,89.25 180 top
3-PIN_4  16.42,89.25 180 top
3-PIN_5  76.17,81.87 180 bottom
3-PIN_6  56.25,81.87 180 bottom
3-PIN_7  36.34,81.87 180 bottom
3-PIN_8  16.41,81.87 180 bottom
24-PIN_CONNECTOR  87.38,54.1 0 top
C1  85.08,16.7 180 top
C2  65.11,16.82 180 top
C3  67.28,16.82 180 bottom
C4  47.66,16.73 180 bottom
C5  45.11,16.73 180 top
C6  25.2,16.69 180 top
C7  27.68,16.69 180 bottom
C8  7.55,16.67 180 bottom
C9  89.61,14.73 270 top
C10  89.31,12.66 180 top
C11  88.28,11.13 90 bottom
C12  89.43,10.58 90 top
CS_1  84.48,21.14 180 top
CS_2  64.49,21.2 180 top
CS_3  44.5,21.17 180 top
CS_4  24.55,21.16 180 top
CS_5  67.94,21.2 180 bottom
CS_6  48.31,21.18 180 bottom
CS_7  28.33,21.17 180 bottom
CS_8  8.18,21.16 180 bottom
D1  99.06,11.95 90 top
D2  99.03,93.77 135 top
D3  79.55,17.8 180 top
D4  59.84,17.65 180 top
D5  40.13,17.59 180 top
D6  19.95,17.7 180 top
D7  72.72,17.94 180 bottom
D8  52.84,17.71 180 bottom
D9  32.71,17.46 180 bottom
D10  12.6,17.67 180 bottom
EDGE_CONNECTOR  15.68,0 0 top
F1  76.21,21.15 180 top
F2  56.37,21.17 180 top
F3  36.4,21.15 180 top
F4  16.28,21.13 180 top
F5  76.22,21.16 0 bottom
F6  56.4,21.17 0 bottom
F7  36.4,21.19 0 bottom
F8  16.28,21.13 0 bottom
IC2  5.67,53.89 0 top
IC3  6.2,46.96 270 top
POWER_INPUT  93.11,17.35 0 top
Q1  76.18,16.93 270 top
Q2  56.42,16.65 270 top
Q3  36.45,16.76 270 top
Q4  16.23,16.69 270 top
Q5  76.23,16.92 270 bottom
Q6  56.44,16.67 270 bottom
Q7  36.45,16.76 270 bottom
Q8  16.24,16.69 270 bottom
R1  95.51,12.18 90 top
R2  72.71,17.91 180 top
R3  72.69,16.65 0 top
R4  52.84,17.76 180 top
R5  52.87,16.44 0 top
R6  59.84,16.42 180 top
R7  32.79,17.51 180 top
R8  32.8,16.24 0 top
R9  40.11,16.39 180 top
R10  12.73,17.76 180 top
R11  12.73,16.37 0 top
R12  19.81,16.38 180 top
R13  79.53,17.72 180 bottom
R14  79.51,16.47 0 bottom
R15  72.67,16.67 180 bottom
R16  59.87,17.73 180 bottom
R17  59.88,16.45 0 bottom
R18  79.5,16.45 180 top
R19  52.85,16.49 180 bottom
R20  40.11,17.6 180 bottom
R21  40.1,16.33 0 bottom
R22  32.76,16.23 180 bottom
R23  19.91,17.73 180 bottom
R24  19.91,16.28 0 bottom
R25  12.74,16.33 180 bottom
R26  88.34,17.58 270 top
R27  88.37,14.67 270 top
R28  7.82,54.28 90 top
R38  92.64,12.18 90 top
U$1  56.02,10.03 90 top
U$2  58.67,10.03 90 top
U$3  61.32,10.03 90 top
U$4  63.97,10.03 90 top
U$5  66.63,10.03 90 top
U$6  69.28,10.03 90 top
U$7  71.93,10.03 90 top
U$8  74.58,10.03 90 top
U$11  84.32,12.54 180 top

### Tracks (layer width: path | path; a pad name or v marks a point on that pad's centre or on a via)
+3V3  (via drill 0.35)
  Top 0.254: C9.2 89.55,13.82 R27.2 88.38,12.75 C10.2 88.26,12.86 U$11.V+ 86.37,12.86 86.19,12.67 86.19,11.3 v84.44,9.55 83.67,8.78 54.82,8.78 52.43,11.17 46.93,11.17 | v19.1,8.39 21.89,11.17 46.93,11.17 | EDGE_CONNECTOR.43 49.53,8.57 46.93,11.17 | v90.56,10.16 90.56,10.06 90.23,9.73 C12.1 | v85.82,8.92 85.82,9.54 86.55,10.26 U$11.VREF
  Bottom 0.152: C11.1 88.53,10.54 | v90.56,10.16 90.56,10.21
  Bottom 0.254: v84.44,9.55 86.76,9.55 | 86.76,9.55 87.55,9.55 C11.1 | 90.56,10.21 90.23,10.54 88.53,10.54 | 86.76,9.55 86.12,8.92 v85.82,8.92
  pour Top (no thermals): 15.71,2.92 15.71,7.62 15.76,7.67 16.99,8.9 17.67,8.9 21.06,8.9 22.35,7.61 22.35,2.89 15.73,2.89 15.71,2.92
  pour Bottom (no thermals): 15.67,2.89 15.67,7.62 16.97,8.92 21.06,8.92 21.92,8.07 22.36,7.62 22.36,5.29 22.36,2.89 22.31,2.84 15.71,2.84 15.68,2.88
+5V  (via drill 0.35)
  Top 0.152: 78.66,15.95 78.66,16.39 R18.2
  Top 0.508: CS_1.VCC 86.39,17.16 C1.1 86.83,16.7 86.92,16.61 v87.04,16.61 | CS_2.VCC 66.4,17.26 C2.1 65.96,15.93 v66.18,15.7 66.45,15.43 71.99,15.43 v72.01,15.45 | CS_3.VCC 46.4,17.17 C5.1 45.96,15.86 v46.41,15.41 51.79,15.41 v51.85,15.34 | CS_4.VCC 26.45,17.09 C6.1 26.05,15.59 v26.28,15.36 30.17,15.36 v30.7,14.84 | v79.53,15.07 78.66,15.95 | v44.45,8.3 44.45,9.71 43.65,10.51 v22.66,10.51 | v19.8,10.51 7.19,10.51 v4.04,13.66 | v6.44,20.67 7.7,20.67 9.94,18.43 v9.94,15.7 | v16.24,15.73 16.86,15.73 16.85,15.75 18.33,15.75 R12.2 20.33,15.01 v20.33,14.3 | v43.66,15.41 40.23,15.41 R9.2 39.26,15.92 v38.18,14.84 | v76.17,15.45 76.29,15.32 77.59,15.32 78.66,16.39 | v56.46,15.14 57.71,15.14 R6.2 60.26,15.16 v64.35,15.16 | IC2.5 4.66,55.26 3.84,55.26 3.35,54.77 3.35,52.31 3.92,51.74 v3.99,51.74 | 9.25,50.76 IC3.14 | 9.25,50.76 7.7,50.76 v7.55,50.9 | 9.25,50.76
  Bottom 0.508: CS_7.VCC 26.43,17.09 C7.1 26.83,15.91 v26.28,15.36 25.19,14.28 20.36,14.28 v20.33,14.3 17.03,14.3 15.26,12.52 13.12,12.52 v9.94,15.7 | CS_6.VCC 46.4,17.14 C4.1 46.81,15.81 v46.41,15.41 v43.66,15.41 | CS_5.VCC 66.03,17.21 C3.1 66.43,15.94 v66.18,15.7 65.65,15.16 v64.35,15.16 | v87.04,16.61 87.02,16.59 87.02,15.91 86.58,15.46 79.86,15.46 79.53,15.13 v79.53,15.07 | v22.66,10.51 v19.8,10.51 | R25.2 14.18,15.73 v16.24,15.73 | v30.7,14.84 32.3,14.84 33.61,16.14 R22.2 35.03,14.81 38.15,14.81 v38.18,14.84 | v72.01,15.45 72.3,15.45 R15.2 73.77,16.67 75.04,15.4 76.12,15.4 v76.17,15.45 | v4.04,13.66 4.04,14.01 C8.1 6.27,17.1 CS_8.VCC 6.27,20.5 v6.44,20.67 4.95,22.16 4.95,38.42 7.3,40.77 7.98,40.77 8.69,41.48 8.69,49.77 v7.55,50.9 6.71,51.74 v3.99,51.74 | v51.85,15.34 52.55,15.34 R19.2 53.87,16.49 55.21,15.14 v56.46,15.14
  pour Top (no thermals): 41.18,2.77 47.76,2.77 47.78,2.75 47.78,7.54 47.3,8.02 46.3,9.03 45.3,9.03 42.52,9.03 41.12,7.63 41.12,2.78 41.13,2.78
  pour Bottom (no thermals): 41.09,2.77 47.78,2.77 47.78,7.54 46.31,9.01 42.52,9.01 42.32,8.81 41.13,7.62 41.13,7.29 41.13,2.81 41.1,2.78
ANALOG_1
  Top 0.152: U$11.IN0 80.24,10.26 79.72,10.78 79.72,14.04 81.06,15.38 84.56,15.38 85.12,15.94 CS_1.VIOUT
ANALOG_2
  Top 0.152: U$11.IN1 82.16,10.91 82.34,10.74 82.34,10.21 81.99,9.86 80.21,9.86 79.42,10.65 79.42,14.06 78.64,14.84 65.84,14.84 65.13,15.56 CS_2.VIOUT
ANALOG_3
  Top 0.152: U$11.IN2 82.22,11.56 82.64,11.13 82.64,10.08 82.11,9.55 80.09,9.55 79.12,10.53 79.12,13.94 78.73,14.32 | 78.73,14.32 | 78.73,14.32 78.52,14.54 45.56,14.54 45.13,14.97 CS_3.VIOUT
ANALOG_4
  Top 0.152: U$11.IN3 82,12.21 82.95,11.26 82.95,9.96 82.24,9.25 79.96,9.25 78.81,10.4 78.81,13.66 78.24,14.23 25.78,14.23 25.18,14.83 CS_4.VIOUT
ANALOG_5  (via drill 0.35)
  Top 0.152: v80.33,13.09 80.56,12.86 U$11.IN4
  Bottom 0.152: v80.33,13.09 80.03,12.79 68.07,12.79 67.3,13.55 CS_5.VIOUT
ANALOG_6  (via drill 0.35)
  Top 0.152: v82.98,13.55 82.95,13.51 U$11.IN5
  Bottom 0.152: v82.98,13.55 82.98,13.12 82.34,12.48 48.57,12.48 47.67,13.39 CS_6.VIOUT
ANALOG_7  (via drill 0.35)
  Top 0.152: v84.04,14.2 83.99,14.16 U$11.IN6
  Bottom 0.152: v84.04,14.2 84.04,13.75 82.53,12.23 82.47,12.18 28.51,12.18 27.7,12.98 CS_7.VIOUT
ANALOG_8  (via drill 0.35)
  Top 0.152: v85.12,14.63 84.94,14.81 U$11.IN7
  Bottom 0.152: v85.12,14.63 85.12,14.4 82.6,11.87 8.28,11.87 7.54,12.61 CS_8.VIOUT
FAULT_1  (via drill 0.35)
  Top 0.152: 75.15,17.91 Q1.1 | 73.56,16.66 R3.2 73.56,16.63 | v73.54,13.62 71.78,11.87 7.89,11.87 3.59,16.16 3.59,21.7 5.11,23.21 5.11,39.78 3.63,41.26 2.18,41.26 1.48,41.97 1.48,49.01 1.98,49.5 IC3.2
  Top 0.2: 75.15,17.91 R2.1 73.56,16.66 | v73.56,15.45 73.56,16.63
  Bottom 0.152: v73.54,13.62 73.54,15.43 v73.56,15.45
FAULT_2  (via drill 0.35)
  Top 0.152: 53.85,17.6 53.77,17.68 | 53.77,17.68 R4.1 | 53.72,17.62 53.77,17.68 | v53.72,13.62 52.61,12.52 8.14,12.52 4.21,16.44 4.21,21.46 5.72,22.96 5.72,40.91 5.04,41.58 2.3,41.58 1.78,42.09 1.78,47.9 2.12,48.23 IC3.3 | 53.71,16.43 R5.2
  Top 0.2: Q2.1 53.85,17.6 | R5.2 53.72,17.62 | v53.71,15.14 53.71,16.43
  Bottom 0.152: v53.72,13.62 v53.72,15.13 v53.71,15.14
FAULT_3  (via drill 0.35)
  Top 0.152: R7.1 33.65,17.49 | v12.88,14.31 7.67,14.31 5.13,16.84 5.13,21.09 6.63,22.58 6.63,46.45 6.11,46.96 IC3.4 | v33.55,13.62 33.4,13.48 13.87,13.48 v13.86,13.46 | 33.74,16.15 R8.2
  Top 0.2: 33.65,17.49 R8.2 | R7.1 35.24,17.51 Q3.1 | v33.74,14.84 33.74,16.15
  Bottom 0.152: v13.86,13.46 13.73,13.46 v12.88,14.31 | v33.55,13.62 33.74,13.82 v33.74,14.84
FAULT_4
  Top 0.152: R10.1 | R11.2 13.58,14.15 13.09,13.66 7.89,13.66 4.83,16.71 4.83,21.21 6.33,22.71 6.33,45.23 5.86,45.69 IC3.5
  Top 0.2: R10.1 R11.2 | Q4.1 15.12,17.75 R10.1
FAULT_5  (via drill 0.35)
  Top 0.152: v77.99,13.62 75.91,11.54 7.76,11.54 3.28,16.02 3.28,21.82 4.78,23.32 4.78,39.25 v4.5,39.53 | v7.54,41.74 9.93,41.74 10.78,42.59 10.78,43.95 10.31,44.42 IC3.9
  Bottom 0.152: 78.53,17.87 R13.1 78.66,17.7 | R14.2 78.66,14.3 v77.99,13.62 | v4.5,39.53 5.13,39.53 7.33,41.74 v7.54,41.74
  Bottom 0.2: Q5.1 78.53,17.87 | R14.2 78.66,17.7
FAULT_6  (via drill 0.35)
  Top 0.152: v58.66,13.4 57.46,12.2 8,12.2 3.97,16.24 3.97,16.25 3.91,16.31 3.91,21.59 5.41,23.09 5.41,40.35 v5.11,40.66 | v7.54,43.36 7.54,45.21 8.02,45.69 IC3.10
  Bottom 0.152: 58.91,17.62 58.99,17.7 | 58.99,17.7 R16.1 | 59.03,17.66 58.99,17.7 | R17.2 59.03,13.77 v58.66,13.4 | v5.11,40.66 7.54,43.1 v7.54,43.36
  Bottom 0.2: Q6.1 58.91,17.62 | R17.2 59.03,17.66
FAULT_7  (via drill 0.35)
  Top 0.152: v39.21,13.62 39.21,13.41 38.64,12.84 8.25,12.84 4.53,16.57 4.53,21.34 6.02,22.84 6.02,44.67 v5.71,44.98 | v7.54,46.68 7.83,46.96 IC3.11
  Bottom 0.152: R21.2 39.25,13.67 v39.21,13.62 | 37.56,17.6 Q7.1 | v5.71,44.98 7.4,46.68 v7.54,46.68
  Bottom 0.2: R21.2 R20.1 37.56,17.6
FAULT_8  (via drill 0.35)
  Top 0.152: v12.07,14.92 11.94,14.78 7.63,14.78 5.44,16.98 5.44,20.96 6.93,22.46 6.93,47.81 7.36,48.23 IC3.12
  Bottom 0.152: Q8.1 17.33,17.73 | v12.07,14.92 18.33,14.92 19.06,15.65 R24.2
  Bottom 0.2: 17.33,17.73 R23.1 R24.2
FUSE_1_TRIGGER
  Top 0.152: F1.P$2 72.92,21.03 71.86,19.97
  Top 0.2: 71.86,19.97 R2.2
  Top 2.54: 72.92,21.03 71.08,22.86 71.08,34.16 2-PIN_1.P$1
FUSE_2_TRIGGER
  Top 0.152: 51.99,19.96 52.98,20.94 F2.P$2
  Top 0.2: R4.2 51.99,19.96
  Top 2.54: 52.98,20.94 51.15,22.77 51.15,34.15 2-PIN_2.P$1
FUSE_3_TRIGGER
  Top 0.152: 33.21,20.84 F3.P$2
  Top 0.2: R7.2 33.21,18.78 33.21,20.84
  Top 2.54: 33.21,20.84 31.25,22.8 31.25,34.16 2-PIN_3.P$1
FUSE_4_TRIGGER
  Top 0.152: 13.09,20.74 F4.P$2
  Top 0.2: R10.2 13.09,18.97 13.09,20.74
  Top 2.54: 13.09,20.74 11.26,22.57 11.26,34.09 2-PIN_4.P$1
FUSE_5_TRIGGER
  Bottom 0.152: 80.38,20.19 79.45,21.12 F5.P$1
  Bottom 0.2: R13.2 80.38,20.19
  Bottom 2.54: 79.45,21.12 78.71,21.86 2-PIN_5.P$1
FUSE_6_TRIGGER
  Bottom 0.152: 60.72,20.04 59.67,21.09 F6.P$1
  Bottom 0.2: R16.2 60.72,20.04
  Bottom 2.54: 59.67,21.09 58.79,21.97 2-PIN_6.P$1
FUSE_7_TRIGGER
  Bottom 0.152: F7.P$1 39.62,21.16 40.96,19.82
  Bottom 0.2: 40.96,19.82 R20.2
  Bottom 2.54: 2-PIN_7.P$1 38.88,21.9 F7.P$1 39.62,21.16
FUSE_8_TRIGGER
  Bottom 0.2: R23.2 19.47,19.02 19.47,20.88 F8.P$1
  Bottom 2.54: 2-PIN_8.P$1 18.96,21.39 19.47,20.88
FUSED_1
  pour Top (no thermals): 82.3,24.85 80.47,23.03 79.22,23.03 77.34,23.03 77.33,23.04 77.33,19.28 77.35,19.27 81.48,19.27 81.5,19.3 81.5,21.88 82.26,22.64 84.12,22.64 84.12,24.86 82.32,24.86 82.3,24.85
FUSED_2
  pour Top (no thermals): 62.31,24.91 60.41,23.02 59.98,23.02 57.51,23.02 57.51,19.3 61.63,19.3 61.63,21.98 62.31,22.66 64.12,22.66 64.13,22.65 64.13,24.91 64.13,24.91 62.33,24.91 62.31,24.92
FUSED_3
  pour Top (no thermals): 44.14,24.87 42.32,24.87 42.13,24.68 40.49,23.03 39.59,23.03 37.53,23.03 37.53,19.31 37.53,19.3 41.68,19.3 41.68,19.3 41.68,22.01 42.31,22.64 42.34,22.67 44.13,22.67 44.13,24.84 44.15,24.86
FUSED_4
  pour Top (no thermals): 24.19,24.85 24.19,22.73 24.2,22.72 22.4,22.72 21.52,21.84 21.52,19.29 17.39,19.29 17.39,19.29 17.39,22.98 17.39,22.98 20.45,22.98 22.35,24.88 24.16,24.88
FUSED_5
  pour Bottom (no thermals): 68.3,24.87 68.3,22.78 69.01,22.78 70.1,22.78 70.82,22.06 70.99,21.89 70.99,21.71 70.99,19.33 72.39,19.33 75.11,19.33 75.11,19.77 75.11,23.01 74.55,23.01 71.96,23.01 70.06,24.91 68.35,24.91 68.31,24.87
FUSED_6
  pour Bottom (no thermals): 48.66,24.88 48.66,22.76 49.18,22.76 50.44,22.76 50.79,22.41 51.16,22.03 51.16,19.33 51.99,19.33 55.25,19.33 55.25,19.78 55.25,23.03 55.01,23.03 52.36,23.03 50.51,24.89 48.68,24.89 48.67,24.88
FUSED_7
  pour Bottom (no thermals): 28.67,24.87 28.67,22.74 29.58,22.74 30.48,22.74 31.17,22.05 31.17,19.39 32.41,19.39 35.26,19.39 35.26,19.89 35.26,23.04 32.39,23.04 30.56,24.86 28.68,24.86 28.67,24.86
FUSED_8
  pour Bottom (no thermals): 8.56,24.9 8.56,22.71 8.57,22.69 10.34,22.69 11.04,21.99 11.04,19.36 11.08,19.32 15.1,19.32 15.16,19.39 15.16,23 15.18,23.01 12.3,23.01 10.41,24.9
GND  (via drill 0.35)
  Top 0.152: C12.2 90.16,12.16 C10.1 | C12.2 90.45,11.43 v90.47,11.4 | 99.06,13.89 v99.05,13.9 | v16.21,16.69 16.21,16.59 15.37,15.74 Q4.2 | C9.1 89.61,16.74 v89.6,16.75 | R26.1 v88.34,19.49 | C12.2 88.72,11.43 88.24,11.91 87.84,11.91 87.54,12.21 U$11.GND | IC2.3 7.1,52.6 v7.5,52.2 | v10.79,16.36 | v30.75,16.24 | 50.91,16.44 v50.9,16.43 | IC3.7 v3.12,42.29 | v56.4,16.68
  Top 0.2: R11.1 v10.79,16.36 | R8.1 v30.75,16.24 | R5.1 50.91,16.44 | R3.1 v70.69,16.65 v70.69,16.64 | Q3.2 36.39,16.75 v36.39,16.84 | Q2.2 v56.4,16.68 | Q1.2 76.09,16.89 v76.18,16.89
  Top 0.254: D2.C 98.54,94.51 v99.7,94.51
  Top 0.508: CS_3.GND CS_3.BW_SEL 44.27,18.14 C5.2 v43.15,16.73 | D1.C 99.06,13.89 | CS_1.GND CS_1.BW_SEL 84.23,18.14 C1.2 83.14,16.7 v83.11,16.68 | CS_2.GND CS_2.BW_SEL 64.26,18.19 C2.2 63.12,16.82 v63.1,16.8 | CS_4.GND CS_4.BW_SEL 24.35,18.1 C6.2 24.31,16.74 23.19,16.74 v23.18,16.73
  Bottom 0.254: v99.7,94.51 100.03,94.18 100.03,66.46 100.08,66.42 100.08,44.01 POWER_INPUT.7-
  other vias: 25.49,21.15 26.52,21.15 26.52,22.07 25.49,22.07 45.44,22.07 45.43,21.12 46.38,21.09 46.34,22.06 65.3,22.04 66.24,22.02 66.23,21.03 65.3,21.01 26.7,8.14 36.9,8.12 85.23,20.78 86.39,20.78 86.39,22.02 85.23,22.02
  pour Top (no thermals): 24.92,25.29 24.92,20.54 27.06,20.54 27.06,25.29
  pour Top (no thermals): 44.82,25.2 44.82,20.45 46.95,20.45 46.95,25.2
  pour Top (no thermals): 64.74,25.13 64.74,20.37 66.87,20.37 66.87,25.13
  pour Top (no thermals): 84.75,24.97 84.75,20.21 86.89,20.21 86.89,24.97
  pour Bottom (rank 2): 0,7.65 101.61,7.65 101.61,9.04 101.61,101.59 97.96,101.59 0,101.59 0,99.29 0,7.65 0.12,7.65
  pour Bottom (no thermals): 5.57,25.47 8.23,25.47 8.23,21.87 5.57,21.87
  pour Bottom (no thermals): 8.17,19.72 8.17,15.55 10.1,15.55 10.73,15.55 10.73,20.22 8.17,20.22 8.17,19.64
  pour Bottom (no thermals): 25.66,25.3 28.32,25.3 28.32,21.7 25.66,21.7
  pour Bottom (no thermals): 45.64,25.31 48.31,25.31 48.31,21.71 45.64,21.71
  pour Bottom (no thermals): 65.21,25.16 67.87,25.16 67.87,21.56 65.21,21.56
  pour Bottom (no thermals): 28.34,19.84 28.34,15.67 30.84,15.67 30.84,20.33 28.34,20.33 28.34,19.76
  pour Bottom (no thermals): 48.28,20.01 48.28,15.83 50.21,15.83 50.84,15.83 50.84,20.5 48.28,20.5 48.28,19.93
  pour Bottom (no thermals): 67.97,19.71 67.97,15.54 69.9,15.54 70.53,15.54 70.53,20.2 67.97,20.2 67.97,19.63
  pour Bottom (no thermals): 23.45,2.88 29.98,2.88 29.99,2.87 29.99,7.57 29.81,7.75 28.67,8.9 25.51,8.9 24.66,8.9 23.34,7.57 23.34,2.88 23.35,2.88
  pour Top (no thermals): 23.32,7.6 24.19,8.46 24.56,8.84 26.61,8.84 28.75,8.84 30.02,7.57 30.02,2.87 30.02,2.87 23.33,2.87 23.32,2.87
  pour Top (no thermals): 33.48,7.55 34.34,8.42 34.72,8.79 36.76,8.79 38.91,8.79 40.18,7.52 40.18,2.83 40.18,2.82 33.48,2.82 33.48,2.83
  pour Bottom (no thermals): 33.56,2.83 40.1,2.83 40.1,2.82 40.1,7.53 39.93,7.71 38.78,8.85 35.62,8.85 34.78,8.85 33.45,7.53 33.45,2.84 33.46,2.83
  pour Bottom (no thermals): 95.94,40.39 95.94,15.47 96.02,15.4 100.81,15.4 100.87,15.45 100.87,44.6 100.85,44.62 95.94,44.62 95.94,40.32
N$1
  Top 2.54: 3-PIN_5.BLUE 86.48,87.1 24-PIN_CONNECTOR.8,BLUE
N$2
  Bottom 2.54: 24-PIN_CONNECTOR.8,GREEN 83.74,84.1 82.3,85.54 79.84,85.54 3-PIN_5.GREEN
N$3
  Bottom 2.54: 3-PIN_5.WHITE 74.76,78.2 82.52,78.2 85.42,81.1 24-PIN_CONNECTOR.8,WHITE
N$4
  Top 2.54: 3-PIN_1.GREEN 76.52,89.25 80.19,92.93 90.48,92.93 93.13,90.28 93.13,85.8 91.43,84.1 24-PIN_CONNECTOR.7,GREEN
N$5
  Top 2.54: 3-PIN_1.BLUE 77.45,95.62 91.6,95.62 95.82,91.4 95.82,84.69 92.24,81.1 24-PIN_CONNECTOR.7,BLUE
N$6
  Top 2.54: 3-PIN_1.WHITE 82.07,90.08 89.48,90.08 90.38,89.18 24-PIN_CONNECTOR.7,WHITE
N$7
  Top 2.54: 3-PIN_6.BLUE 65.1,78.1 24-PIN_CONNECTOR.6,BLUE
N$8
  Top 2.54: 24-PIN_CONNECTOR.6,GREEN 63.02,75.1 3-PIN_6.GREEN
N$9
  Top 2.54: 3-PIN_6.WHITE 60.94,72.1 24-PIN_CONNECTOR.6,WHITE
N$10
  Bottom 2.54: 3-PIN_2.WHITE 64.85,92.77 69.88,92.77 70.03,92.93 90.47,92.93 93.08,90.32 93.08,79.64 91.54,78.1 24-PIN_CONNECTOR.5,WHITE
N$11
  Bottom 2.54: 24-PIN_CONNECTOR.5,GREEN 90.68,75.41 92.65,75.41 95.77,78.53 95.77,91.44 91.59,95.62 60.49,95.62 56.25,91.38 3-PIN_2.GREEN
N$12
  Bottom 2.54: 3-PIN_2.BLUE 51.17,93.17 56.31,98.31 92.7,98.31 98.46,92.55 98.46,77.41 93.15,72.1 24-PIN_CONNECTOR.5,BLUE
N$13
  Top 2.54: 3-PIN_7.BLUE 54.18,69.1 24-PIN_CONNECTOR.4,BLUE
N$14
  Top 2.54: 24-PIN_CONNECTOR.4,GREEN 52.1,66.1 3-PIN_7.GREEN
N$15
  Top 2.54: 24-PIN_CONNECTOR.4,WHITE 50.02,63.1 3-PIN_7.WHITE
N$16
  Bottom 2.54: 3-PIN_3.WHITE 41.42,92.82 35.85,98.39 11.08,98.39 3.17,90.48 3.17,77.27 34.43,46.01 93.66,46.01 98.44,50.79 98.44,64.38 93.71,69.1 24-PIN_CONNECTOR.3,WHITE
N$17
  Bottom 2.54: 24-PIN_CONNECTOR.3,GREEN 92.89,66.1 95.75,63.24 95.75,51.91 92.56,48.72 35.54,48.72 5.87,78.39 5.87,89.37 12.19,95.69 32.66,95.69 36.34,92.02 3-PIN_3.GREEN
N$18
  Bottom 2.54: 24-PIN_CONNECTOR.3,BLUE 92.08,63.1 93.05,62.13 93.05,53.02 91.45,51.42 36.64,51.42 27.9,60.16 27.9,85.9 3-PIN_3.BLUE
N$19
  Top 2.54: 3-PIN_4.WHITE 21.5,91.96 17.84,95.62 8.31,95.62 3.04,90.34 3.04,77.41 34.42,46.02 91.56,46.02 95.76,50.22 95.76,56.55 92.21,60.1 24-PIN_CONNECTOR.1,WHITE
N$20
  Top 2.54: 3-PIN_4.BLUE 8.61,86.53 8.61,79.45 36.65,51.41 89.33,51.41 90.38,52.45 24-PIN_CONNECTOR.1,BLUE
N$21
  Top 2.54: 24-PIN_CONNECTOR.1,GREEN 91.4,57.1 93.07,55.43 93.07,51.34 90.45,48.72 35.54,48.72 5.73,78.53 5.73,89.23 9.42,92.93 14.57,92.93 16.42,91.07 3-PIN_4.GREEN
N$22
  Top 2.54: 24-PIN_CONNECTOR.2,BLUE 43.26,60.1 3-PIN_8.BLUE
N$23
  Top 2.54: 3-PIN_8.GREEN 41.18,57.1 24-PIN_CONNECTOR.2,GREEN
N$24
  Top 2.54: 24-PIN_CONNECTOR.2,WHITE 39.1,54.1 3-PIN_8.WHITE
N$26
  Top 0.152: R1.1
  Top 0.508: R38.1 R1.1 | R1.1 98.77,10.78 D1.A
N$31
  Top 0.152: 7.76,55.19 R28.2
  Top 0.254: IC2.4 7.76,55.19
N$32
  Top 0.2: Q1.3 78.15,17.8 D3.C
N$33
  Top 0.152: 80.43,16.52 R18.1
  Top 0.2: D3.A 80.43,16.52
N$34
  Top 0.2: D4.C 58.52,17.65 Q2.3
N$36
  Top 0.152: 60.72,16.45 R6.1
  Top 0.2: D4.A 60.72,16.45
N$37
  Top 0.2: Q3.3 37.71,16.76 38.54,17.59 D5.C
N$40
  Top 0.152: 41.01,16.44 R9.1
  Top 0.2: D5.A 41.01,16.44
N$41
  Top 0.152: Q4.3 17.38,16.69
  Top 0.2: D6.C 18.39,17.7 17.38,16.69
N$42
  Top 0.2: D6.A 20.82,16.54 R12.1
N$44
  Bottom 0.152: D7.C 74.1,17.94
  Bottom 0.2: 74.1,17.94 Q5.3
N$45
  Bottom 0.2: D7.A 71.85,16.7
  Bottom 0.508: 71.85,16.7 R15.1
N$46
  Bottom 0.152: Q6.3
  Bottom 0.2: D8.C 54.31,17.71 Q6.3
N$47
  Bottom 0.152: D8.A 51.99,17.68
  Bottom 0.2: 51.99,17.68 R19.1
N$48
  Bottom 0.2: Q7.3 34.65,17.46 D9.C
N$50
  Bottom 0.152: 31.78,16.36 R22.1
  Bottom 0.2: 31.78,16.36 31.78,17.4 D9.A
N$51
  Bottom 0.2: D10.C 14.15,17.67 Q8.3
N$53
  Bottom 0.152: D10.A 11.89,17.51
  Bottom 0.2: 11.89,17.51 R25.1
N$56
  Top 0.254: R28.1 9.06,53.43 18.11,44.38 92.59,44.38 100.23,52.02 100.23,92.57 D2.A
N$62
  Top 0.152: U$11.A0 U$11.A1 87.9,15.52 R27.1 88.38,16.7 R26.2
NOR_1_OUT
  Top 0.152: IC3.1 4.39,50.77 4.72,51.1 IC2.1
NOR_2_OUT
  Top 0.152: IC2.2 5.67,49.8 5.97,49.5 IC3.13
PWM_1
  Bottom 0.152: EDGE_CONNECTOR.20 64.77,6.57 64.49,6.85 57.52,6.85 56.02,8.35 U$1.PWM
PWM_2
  Bottom 0.152: EDGE_CONNECTOR.21 67.31,6.85 67,7.15 60.08,7.15 58.67,8.57 U$2.PWM
PWM_3
  Bottom 0.152: EDGE_CONNECTOR.22 69.85,6.91 69.3,7.46 62.29,7.46 61.32,8.43 U$3.PWM
PWM_4
  Bottom 0.152: EDGE_CONNECTOR.23 72.39,7.15 71.78,7.76 65.01,7.76 63.97,8.8 U$4.PWM
PWM_5
  Bottom 0.152: EDGE_CONNECTOR.24 74.93,7.17 74.03,8.07 67.75,8.07 66.62,9.2 U$5.PWM
PWM_6
  Bottom 0.152: EDGE_CONNECTOR.25 77.47,7.18 76.28,8.37 70.2,8.37 69.28,9.3 U$6.PWM
PWM_7
  Bottom 0.152: EDGE_CONNECTOR.26 80.01,7.34 78.65,8.7 72.8,8.7 71.93,9.58 U$7.PWM
PWM_8
  Bottom 0.152: EDGE_CONNECTOR.27 82.55,7.64 81.18,9.01 75.26,9.01 74.58,9.69 U$8.PWM
SCL
  Top 0.152: U$11.SCL 87.83,11.56 88,11.4 88,9.64 86.23,7.88 80.57,7.88 80.01,7.32 EDGE_CONNECTOR.31
SDA
  Top 0.152: U$11.SDA 86.66,10.91 83.93,8.18 78.34,8.18 77.47,7.31 EDGE_CONNECTOR.32
VOLTAGE_INPUT
  pour Top (no thermals): 91.04,12.21 97.29,12.21 97.66,12.58 97.66,15.58 97.37,15.87 97.37,43.76 97.07,44.05 11.88,44.05 11.66,43.83 11.34,43.52 11.34,36.14 11.34,27.2 11.35,27.2 11.63,26.91 11.67,26.91 21.11,26.91 89.98,26.91 90.41,26.48 90.41,12.52 90.69,12.24 90.72,12.21 91.33,12.21

### Text on the board
tPlace: The Underwater Robotics Team / Center for Automotive Research | ESC Carrier